# EAGLE design GPRS-Shield-v3.0 (EAGLE 6.4)

## Sheet 1 of 2
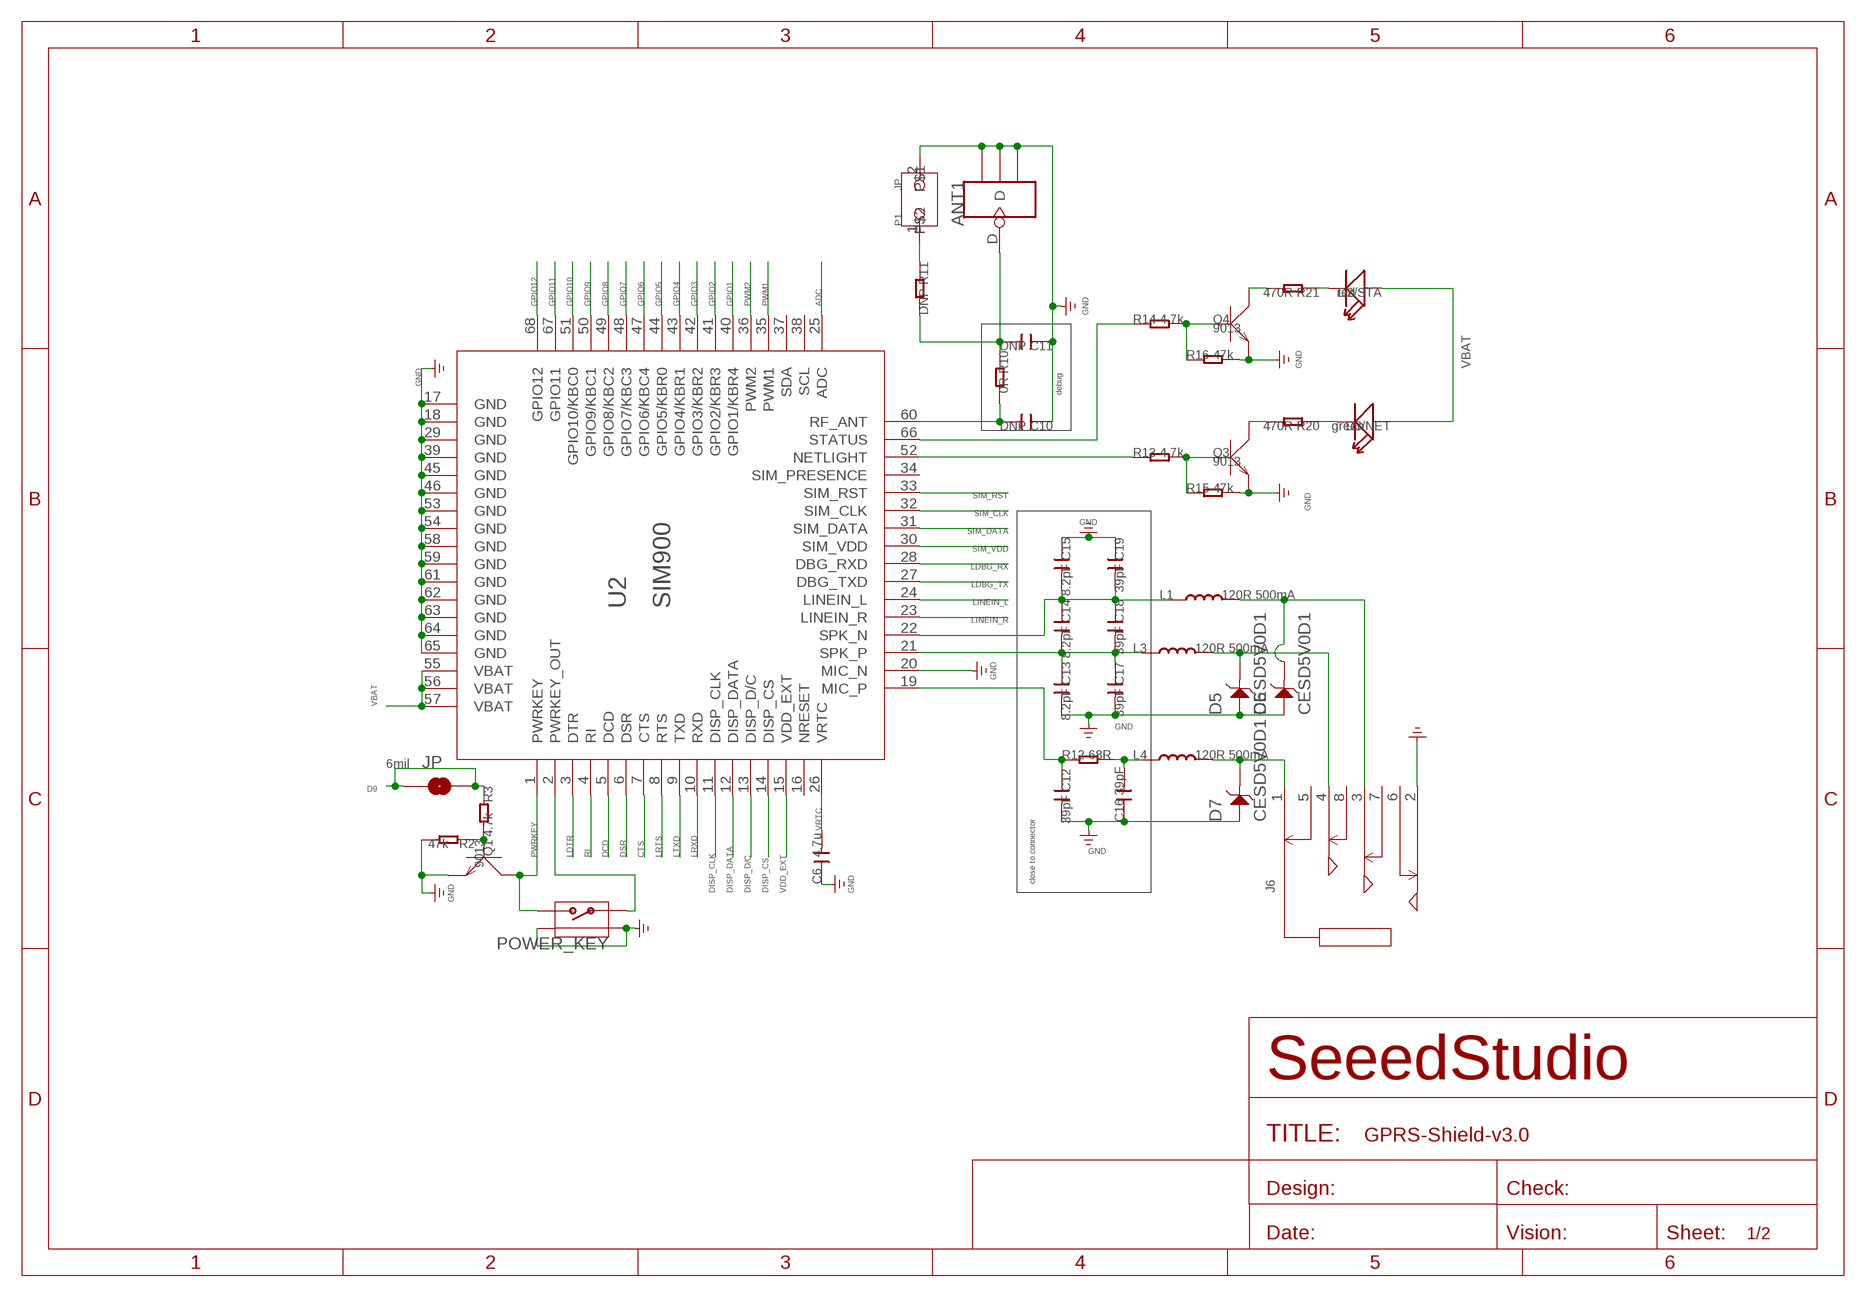
[diagram p0: schematic, sheet 1, part 1 of 2]
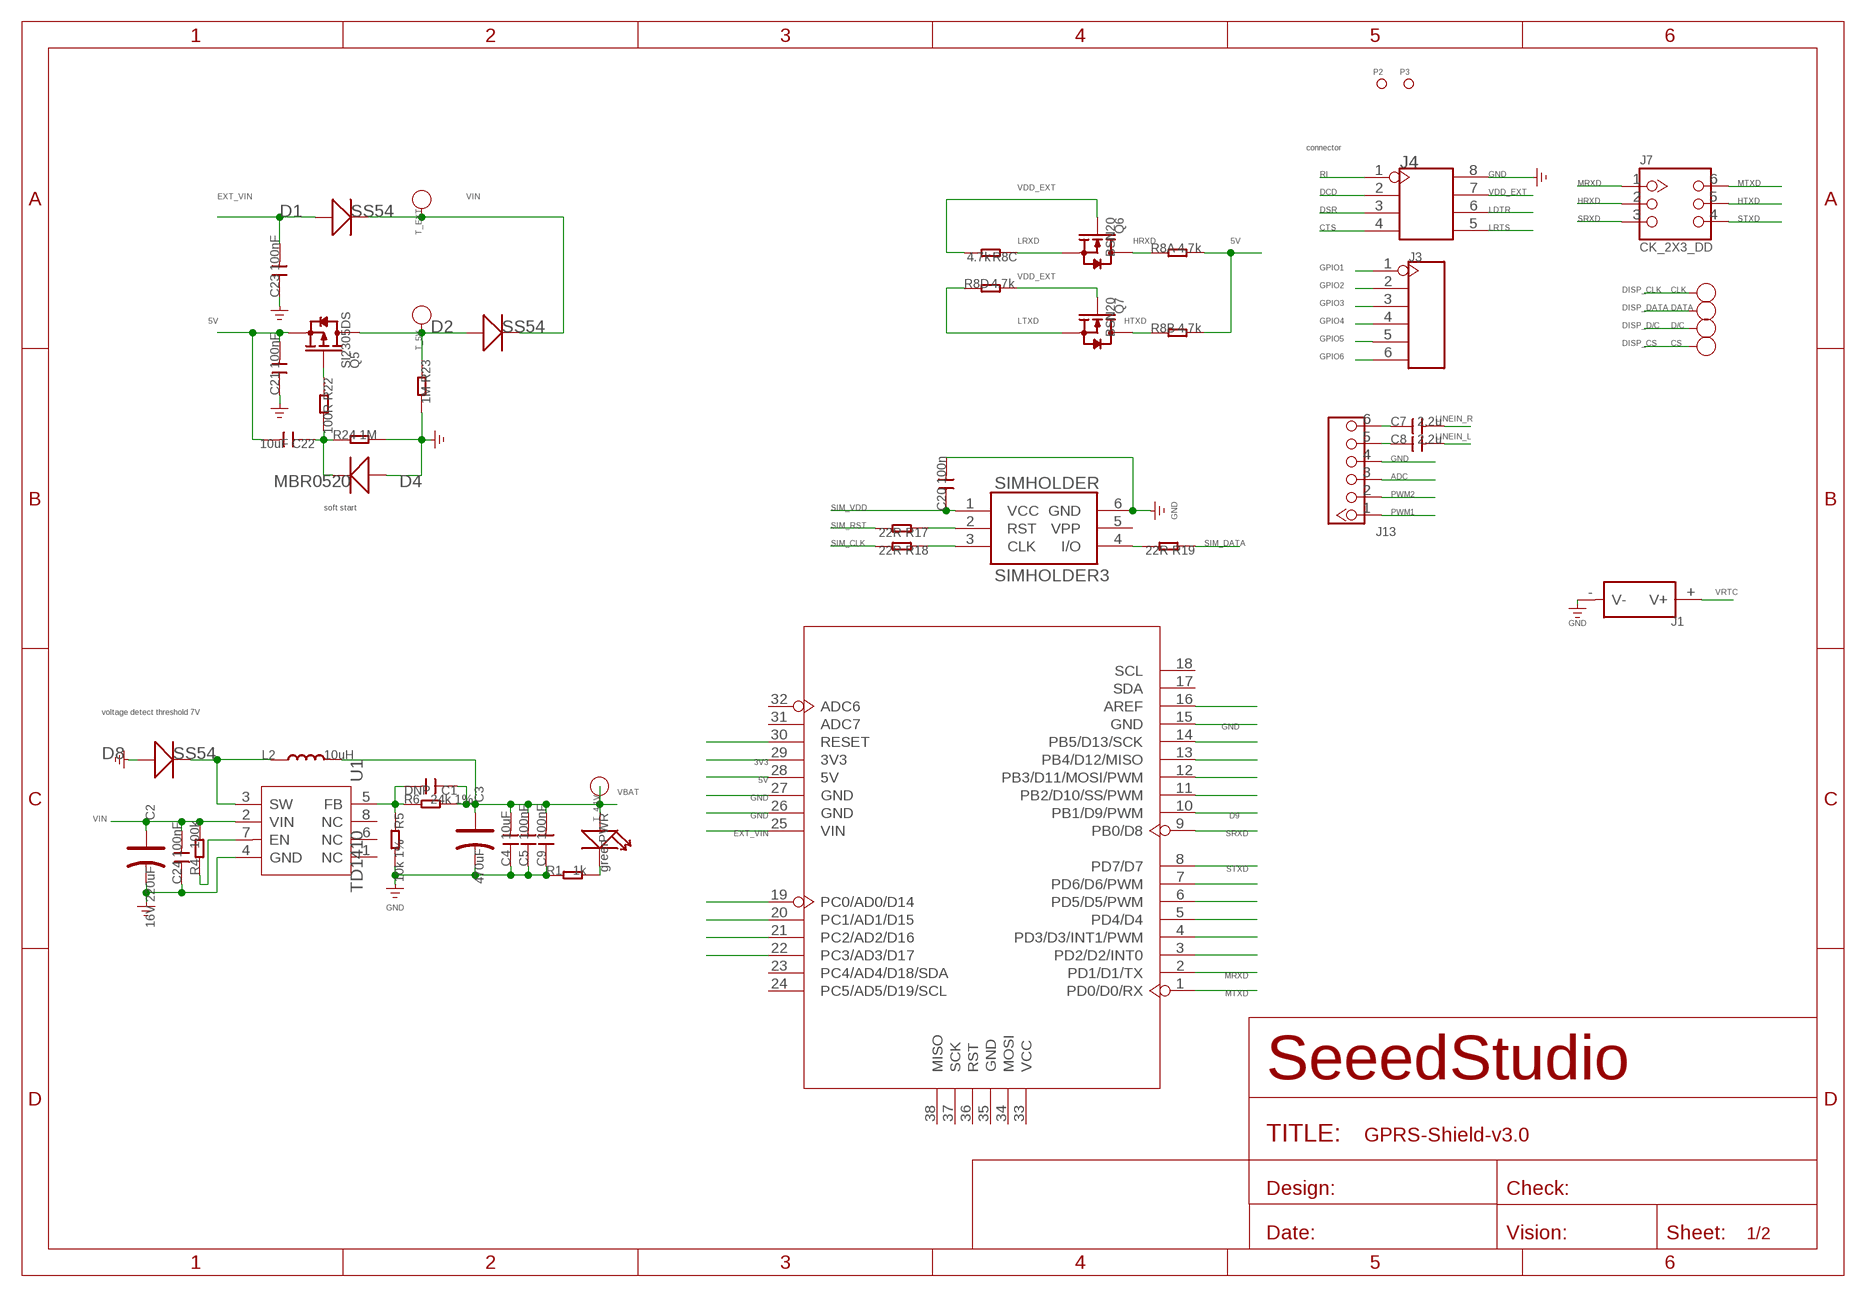
[diagram p1: schematic, sheet 1, part 2 of 2]

### Parts
ANT1  ANTENNA-U-FL  [4P-U-FL]
C1  DNP  C-0603  [C0603]
C2  16V 220uF  CAP-ELECTRO-D  [ELECTRO-SMD-D-5.6MM]
C3  470uF  CAP-AVX-D  [AVX-D]
C4  10uF  C-0805  [C0805]
C5  100nF  C-0603  [C0603]
C6  4.7u  C-0805  [C0805]
C7  2.2u  C-0805  [C0805]
C8  2.2u  C-0805  [C0805]
C9  100nF  C-0603  [C0603]
C10  DNP  C-0603  [C0603]
C11  DNP  C-0603  [C0603]
C12  39pF  C-0603  [C0603]
C13  8.2pF  C-0603  [C0603]
C14  8.2pF  C-0603  [C0603]
C15  8.2pF  C-0603  [C0603]
C16  39pF  C-0603  [C0603]
C17  39pF  C-0603  [C0603]
C18  39pF  C-0603  [C0603]
C19  39pF  C-0603  [C0603]
C20  100n  C-0603  [C0603]
C21  100nF  C-0603  [C0603]
C22  10uF  C-0805  [C0805]
C23  100nF  C-0603  [C0603]
C24  100nF  C-0603  [C0603]
CLK  PAD-TEST-POINT-CIRCLE'4545'  [TP_4545]
CS  PAD-TEST-POINT-CIRCLE'4545'  [TP_4545]
D1  SS54  D'MBRS240LT3'  [SMB]
D2  SS54  D'MBRS240LT3'  [SMB]
D2/STA  red  LED'0603'  [LED-0603]
D3/NET  green  LED'0603'  [LED-0603]
D4  MBR0520  D'MBR0520LT1'  [SOD123-2.7X1.6]
D5  CESD5V0D1  D-ESD  [SOD123-2.7X1.6]
D6  CESD5V0D1  D-ESD  [SOD123-2.7X1.6]
D7  CESD5V0D1  D-ESD  [SOD123-2.7X1.6]
D8  SS54  D'MBRS240LT3'  [SMB]
D/C  PAD-TEST-POINT-CIRCLE'4545'  [TP_4545]
DATA  PAD-TEST-POINT-CIRCLE'4545'  [TP_4545]
J1  HOLDER-BAT  [SMD-CR1220-2]
J3  HEADER-6P-65/35MIL  [6P-2.54-65/35MIL]
J4  HEADER-2X4P-2.54  [2X4P-2.54]
J6  AUDIO-JACK-3.5'PJ-393'  [8P-SMD-3.5]
J7  CK_2X3_DD  [CK_2X3]
J13  HEADER_1X6  [CK_1X6]
JP  PAD-SOLDERJUMPERNC  [2P-SMD-3.3X2]
L1  120R 500mA  L'0603'  [L0603]
L2  10uH  L'0630'  [L0630]
L3  120R 500mA  L'0603'  [L0603]
L4  120R 500mA  L'0603'  [L0603]
P1  JP  [JP]
P2  PAD-MARK  [ROUND-MARK-1.0]
P3  PAD-MARK  [ROUND-MARK-1.0]
POWER_KEY  BUTTON-4P-REINFORCE'TS-118E'  [4P-SMD-7X3.5X3.5H]
PWR  green  007-LED0603  [D0603]
Q1  9013  TRANSISTOR-NPN-SOT23  [SOT23]
Q3  9013  TRANSISTOR-NPN-SOT23  [SOT23]
Q4  9013  TRANSISTOR-NPN-SOT23  [SOT23]
Q5  SI2305DS  MOSFET-P'SI2323CDS/SI2305DS<BR>'  [SOT23]
Q6  BSN20  MOSFET-N'SOT23'  [SOT23]
Q7  BSN20  MOSFET-N'SOT23'  [SOT23]
R1  1k  R-0603  [R0603]
R2  47k  R-0603  [R0603]
R3  4.7k  R-0603  [R0603]
R4  100k  R-0603  [R0603]
R5  10k 1%  R-0603  [R0603]
R6  24k 1%  R-0603  [R0603]
R8  4.7k  R-4R-1206  [1206-8-3.3X2.4]
R10  0R  R-0603  [R0603]
R11  DNP  R-0603  [R0603]
R12  68R  R-0603  [R0603]
R13  4.7k  R-0603  [R0603]
R14  4.7k  R-0603  [R0603]
R15  47k  R-0603  [R0603]
R16  47k  R-0603  [R0603]
R17  22R  R-0603  [R0603]
R18  22R  R-0603  [R0603]
R19  22R  R-0603  [R0603]
R20  470R  R-0603  [R0603]
R21  470R  R-0603  [R0603]
R22  100R  R-0603  [R0603]
R23  1M  R-0603  [R0603]
R24  1M  R-0603  [R0603]
SIMHOLDER  SIMHOLDER3  [SIMHOLDER3]
T_4.1V  PAD-TEST-POINT-CIRCLE'4545'  [TP_4545]
T_5V  PAD-TEST-POINT-CIRCLE'4545'  [TP_4545]
T_EXT  PAD-TEST-POINT-CIRCLE'4545'  [TP_4545]
U1  TD1410  [SOP8]
U2  SIM900  [SIM900]
U4  ARDUINO-38P'WITH/O-SILK'  [ARDUINO-38P-500519002]

### Nets
3V3: U4.29(3V3)
5V: C21.2 C22.2 Q5.2(S) R8.7 R8.8 U4.28(5V)
ADC: J13.3 U2.25(ADC)
CTS: J4.4 U2.7(CTS)
D9: JP.1 JP.2 R3.1 U4.10(PB1/D9/PWM)
DCD: J4.2 U2.5(DCD)
DISP_CLK: CLK.T U2.11(DISP_CLK)
DISP_CS: CS.T U2.14(DISP_CS)
DISP_D/C: D/C.T U2.13(DISP_D/C)
DISP_DATA: DATA.T U2.12(DISP_DATA)
DSR: J4.3 U2.6(DSR)
EXT_VIN: C23.2 D1.+ U4.25(VIN)
GND: ANT1.GND1 ANT1.GND2 ANT1.GND3 C2.- C3.- C4.1 C5.1 C6.1 C9.1 C10.1 C11.1 C12.2 C13.2 C15.1 C16.1 C17.2 C19.1 C20.2 C21.1 C23.1 C24.1 D4.1(+) D5.1 D6.1 D7.1 D8.+ J1.-(V-) J4.8 J6.2 J13.4 P1.2 POWER_KEY.S1 POWER_KEY.S2 Q1.2(E) Q3.2(E) Q4.2(E) R1.1 R2.2 R5.2 R15.2 R16.2 R23.2 R24.2 SIMHOLDER.6(GND) U1.4(GND) U2.17(GND) U2.18(GND) U2.20(MIC_N) U2.29(GND) U2.39(GND) U2.45(GND) U2.46(GND) U2.53(GND) U2.54(GND) U2.58(GND) U2.59(GND) U2.61(GND) U2.62(GND) U2.63(GND) U2.64(GND) U2.65(GND) U4.15(GND) U4.26(GND) U4.27(GND)
GPIO1: J3.1 U2.40(GPIO1/KBR4)
GPIO2: J3.2 U2.41(GPIO2/KBR3)
GPIO3: J3.3 U2.42(GPIO3/KBR2)
GPIO4: J3.4 U2.43(GPIO4/KBR1)
GPIO5: J3.5 U2.44(GPIO5/KBR0)
GPIO6: J3.6 U2.47(GPIO6/KBC4)
GPIO7: U2.48(GPIO7/KBC3)
GPIO8: U2.49(GPIO8/KBC2)
GPIO9: U2.50(GPIO9/KBC1)
GPIO10: U2.51(GPIO10/KBC0)
GPIO11: U2.67(GPIO11)
GPIO12: U2.68(GPIO12)
HRXD: J7.2 Q6.3(D) R8.1
HTXD: J7.5 Q7.3(D) R8.2
LDBG_RX: U2.28(DBG_RXD)
LDBG_TX: U2.27(DBG_TXD)
LDTR: J4.6 U2.3(DTR)
LINEIN_L: C8.2 U2.24(LINEIN_L)
LINEIN_R: C7.2 U2.23(LINEIN_R)
LRTS: J4.5 U2.8(RTS)
LRXD: Q6.2(S) R8.3 U2.10(RXD)
LTXD: Q7.2(S) R8.4 U2.9(TXD)
MRXD: J7.1 U4.2(PD1/D1/TX)
MTXD: J7.6 U4.1(PD0/D0/RX)
N$1: C10.2 R10.2 U2.60(RF_ANT)
N$2: D2.+ Q5.3(D) R23.1 T_5V.T
N$3: Q3.3(C) R20.2
N$4: R19.2 SIMHOLDER.4(I/O)
N$5: R18.1 SIMHOLDER.3(CLK)
N$6: R17.1 SIMHOLDER.2(RST)
N$7: D3/NET.- R20.1
N$8: Q3.1(B) R13.2 R15.1
N$9: PWR.- R1.2
N$10: R13.1 U2.52(NETLIGHT)
N$11: POWER_KEY.1 U2.2(PWRKEY_OUT)
N$12: R4.1 U1.7(EN)
N$13: C12.1 R12.1 U2.19(MIC_P)
N$15: C13.1 C14.2 C17.1 C18.2 L3.1 U2.21(SPK_P)
N$16: Q4.3(C) R21.2
N$17: D2/STA.- R21.1
N$18: Q4.1(B) R14.2 R16.1
N$19: C14.1 C15.2 C18.1 C19.2 L1.1 U2.22(SPK_N)
N$20: R14.1 U2.66(STATUS)
N$21: ANT1.D C11.2 R10.1 R11.2
N$23: C7.1 J13.6
N$24: U4.3(PD2/D2/INT0)
N$25: U4.4(PD3/D3/INT1/PWM)
N$26: U4.5(PD4/D4)
N$27: U4.6(PD5/D5/PWM)
N$28: U4.7(PD6/D6/PWM)
N$29: C8.1 J13.5
N$30: C16.2 L4.1 R12.2
N$31: Q5.1(G) R22.1
N$32: U4.11(PB2/D10/SS/PWM)
N$33: U4.12(PB3/D11/MOSI/PWM)
N$34: U4.13(PB4/D12/MISO)
N$35: U4.14(PB5/D13/SCK)
N$36: Q1.1(B) R2.1 R3.2
N$37: U4.16(AREF)
N$38: D8.- L2.1 U1.3(SW)
N$39: C22.1 D4.2(-) R22.2 R24.1
N$41: U4.22(PC3/AD3/D17)
N$42: U4.21(PC2/AD2/D16)
N$43: U4.20(PC1/AD1/D15)
N$44: U4.19(PC0/AD0/D14)
N$45: D7.2 J6.1 L4.2
N$47: C1.2 R5.1 R6.1 U1.5(FB)
N$48: D5.2 J6.4 L3.2
N$50: U4.30(RESET)
N$51: D6.2 J6.3 L1.2
N$52: P1.1 R11.1
PWM1: J13.1 U2.35(PWM1)
PWM2: J13.2 U2.36(PWM2)
PWRKEY: POWER_KEY.2 Q1.3(C) U2.1(PWRKEY)
RI: J4.1 U2.4(RI)
SIM_CLK: R18.2 U2.32(SIM_CLK)
SIM_DATA: R19.1 U2.31(SIM_DATA)
SIM_RST: R17.2 U2.33(SIM_RST)
SIM_VDD: C20.1 SIMHOLDER.1(VCC) U2.30(SIM_VDD)
SRXD: J7.3 U4.9(PB0/D8)
STXD: J7.4 U4.8(PD7/D7)
VBAT: C1.1 C3.+ C4.2 C5.2 C9.2 D2/STA.+ D3/NET.+ L2.2 PWR.+ R6.2 T_4.1V.T U2.55(VBAT) U2.56(VBAT) U2.57(VBAT)
VDD_EXT: J4.7 Q6.1(G) Q7.1(G) R8.5 R8.6 U2.15(VDD_EXT)
VIN: C2.+ C24.2 D1.- D2.- R4.2 T_EXT.T U1.2(VIN)
VRTC: C6.2 J1.+(V+) U2.26(VRTC)
Unconnected: J6.5 J6.6 J6.7 J6.8 SIMHOLDER.5(VPP) U1.1(NC) U1.6(NC) U1.8(NC) U2.16(NRESET) U2.34(SIM_PRESENCE) U2.37(SDA) U2.38(SCL) U4.17(SDA) U4.18(SCL) U4.23(PC4/AD4/D18/SDA) U4.24(PC5/AD5/D19/SCL) U4.31(ADC7) U4.32(ADC6) U4.33(VCC) U4.34(MOSI) U4.35(GND) U4.36(RST) U4.37(SCK) U4.38(MISO)

### Notes on the sheet
- connector
- debug
- soft start
- voltage detect threshold 7V
- 6mil
- close to connector

## Sheet 2 of 2
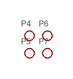
[diagram p2: schematic, sheet 2]

### Parts
P4  PAD-MARK  [ROUND-MARK-1.0]
P5  PAD-MARK  [ROUND-MARK-1.0]
P6  PAD-MARK  [ROUND-MARK-1.0]
P7  PAD-MARK  [ROUND-MARK-1.0]

## Library data of the parts
ANT1 = Connector:ANTENNA-U-FL
C1 C4-C24 = Discrete:C*: Ceramic Capacitors
C2 C3 = Discrete:CAP*: Electrolytic Capacitors,Tantalum Capacitors and Super Capacitors
CLK CS D/C DATA T_4.1V T_5V T_EXT = Discrete:PAD-TEST-POINT-CIRCLE; PARTNO: DNP
D1 D2 D4 D8 = Discrete:D*
D2/STA D3/NET = Discrete:LED*
D5-D7 = template:D-ESD: Diodes for Protectiong against ESD
J1 = Connector:HOLDER-BAT: button cell holder
J3 = Connector:HEADER-6P
J4 = Connector:HEADER-2X4P
J6 = template:AUDIO-JACK-3.5
J7 = CONNECTER:CK_2X3
J13 = CONNECTER:HEADER_1X6
JP = Discrete:PAD-SOLDERJUMPER: Solder Jumper Standard SMD solder jumper. Used to automate production. Two varients : Normally Open and Normally Closed are the same, but have different paste layers. NC will have a large amount of paste and should jumper during reflow.
L1-L4 = Discrete:L*
P1 = mySeeed:JP
P2-P7 = Discrete:PAD-MARK; PARTNO: DNP
POWER_KEY = Discrete:BUTTON-4P-REINFORCE: TS-1188E http://www.best-dz.com/?thread-374-2.html
PWR = Discrete:007-LED*
Q1 Q3 Q4 = Discrete:TRANSISTOR-NPN*: NPN audion
Q5 = Discrete:MOSFET-P
Q6 Q7 = Discrete:MOSFET-N: IRLL014: http://www.vishay.com/docs/91319/sihll014.pdf
R1-R6 R10-R24 = Discrete:R*
R8 = Discrete:R-4R*: Resistor Array
SIMHOLDER = SparkFun2:SIMHOLDER3
U1 = template:TD1410: 2A 380KHz 20V PWM Buck DC/DC Converter
U2 = ICs_v54:SIM900
U4 = moudle:ARDUINO-38P

## Net classes
0 default: clearance 0.152 mm

## Board
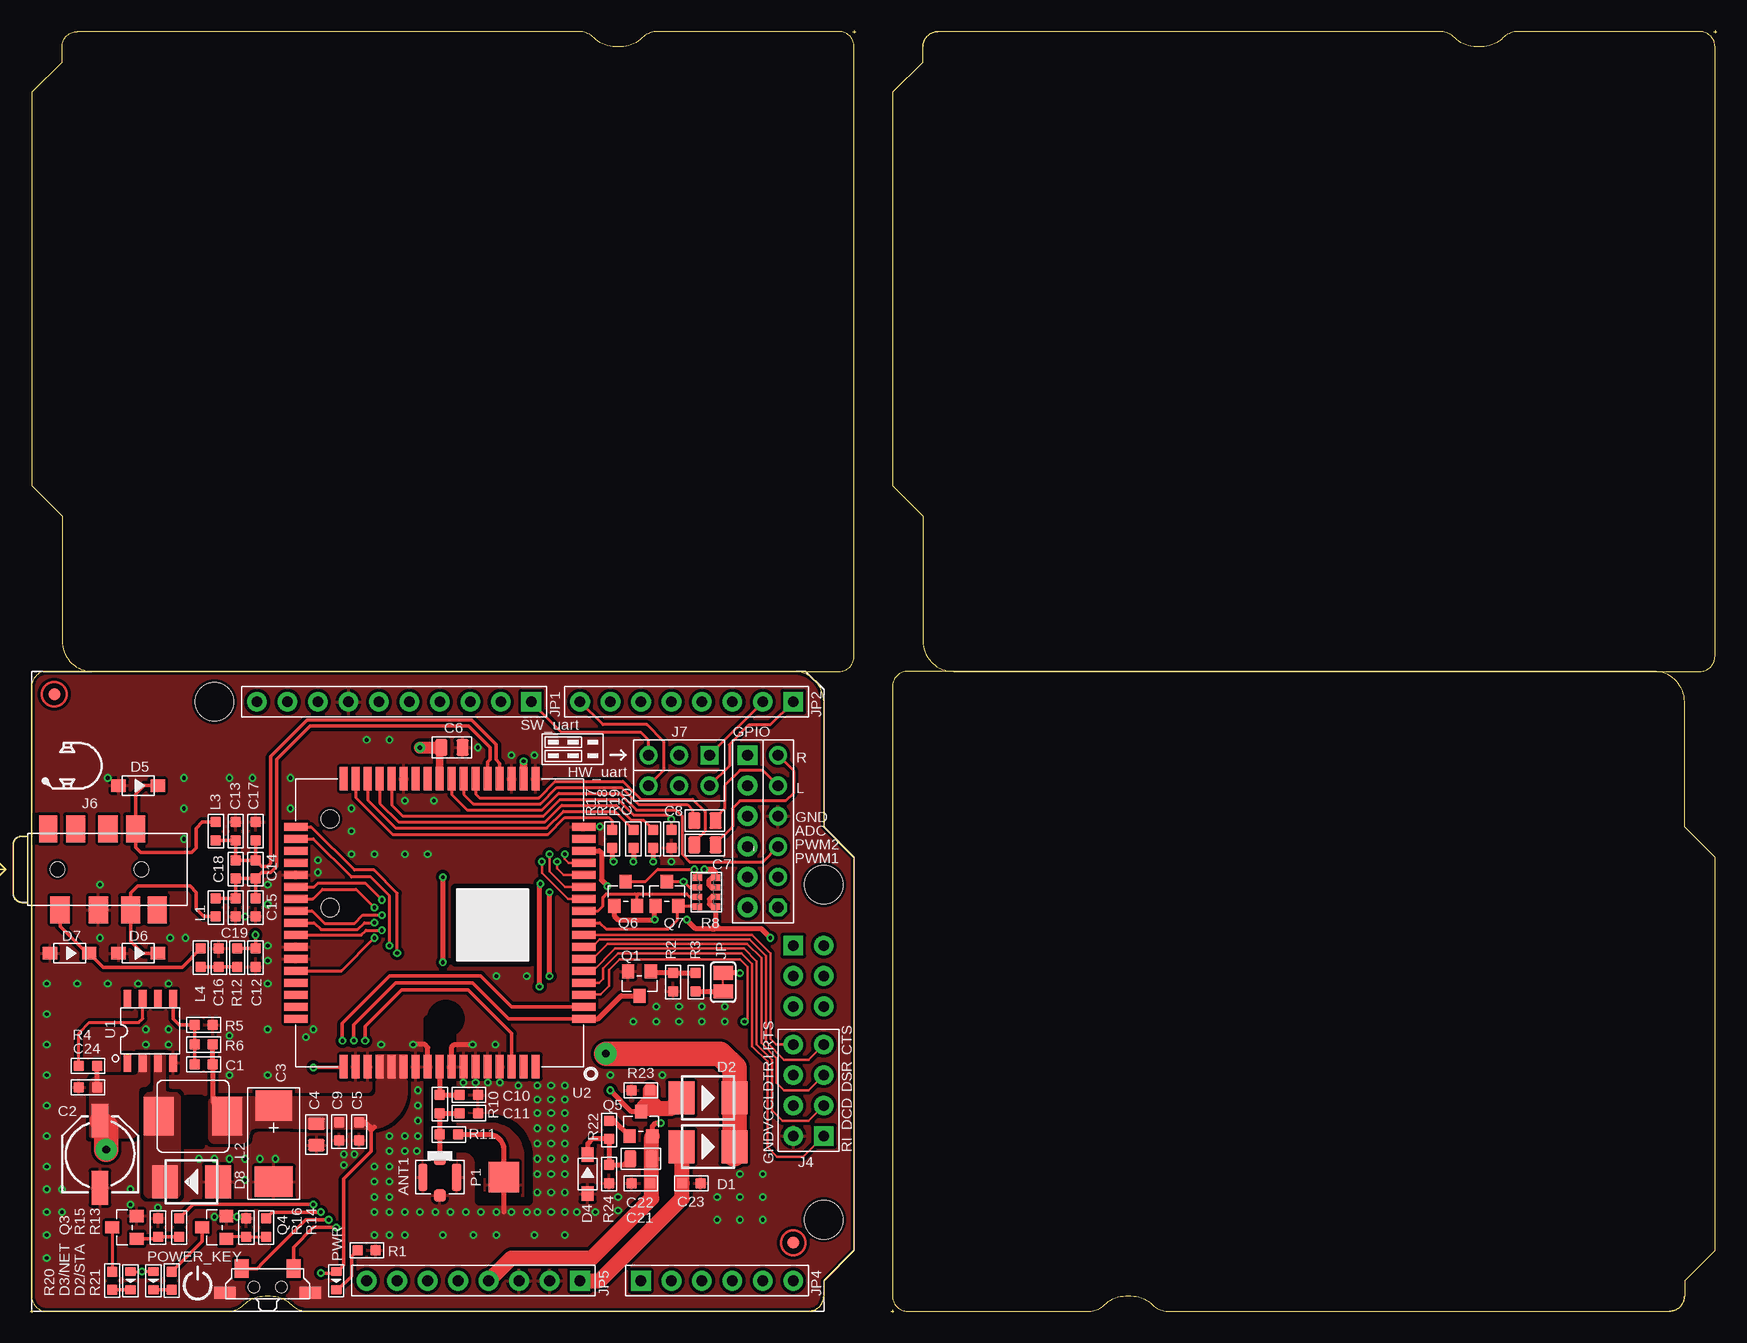
[diagram p3: board, top side]
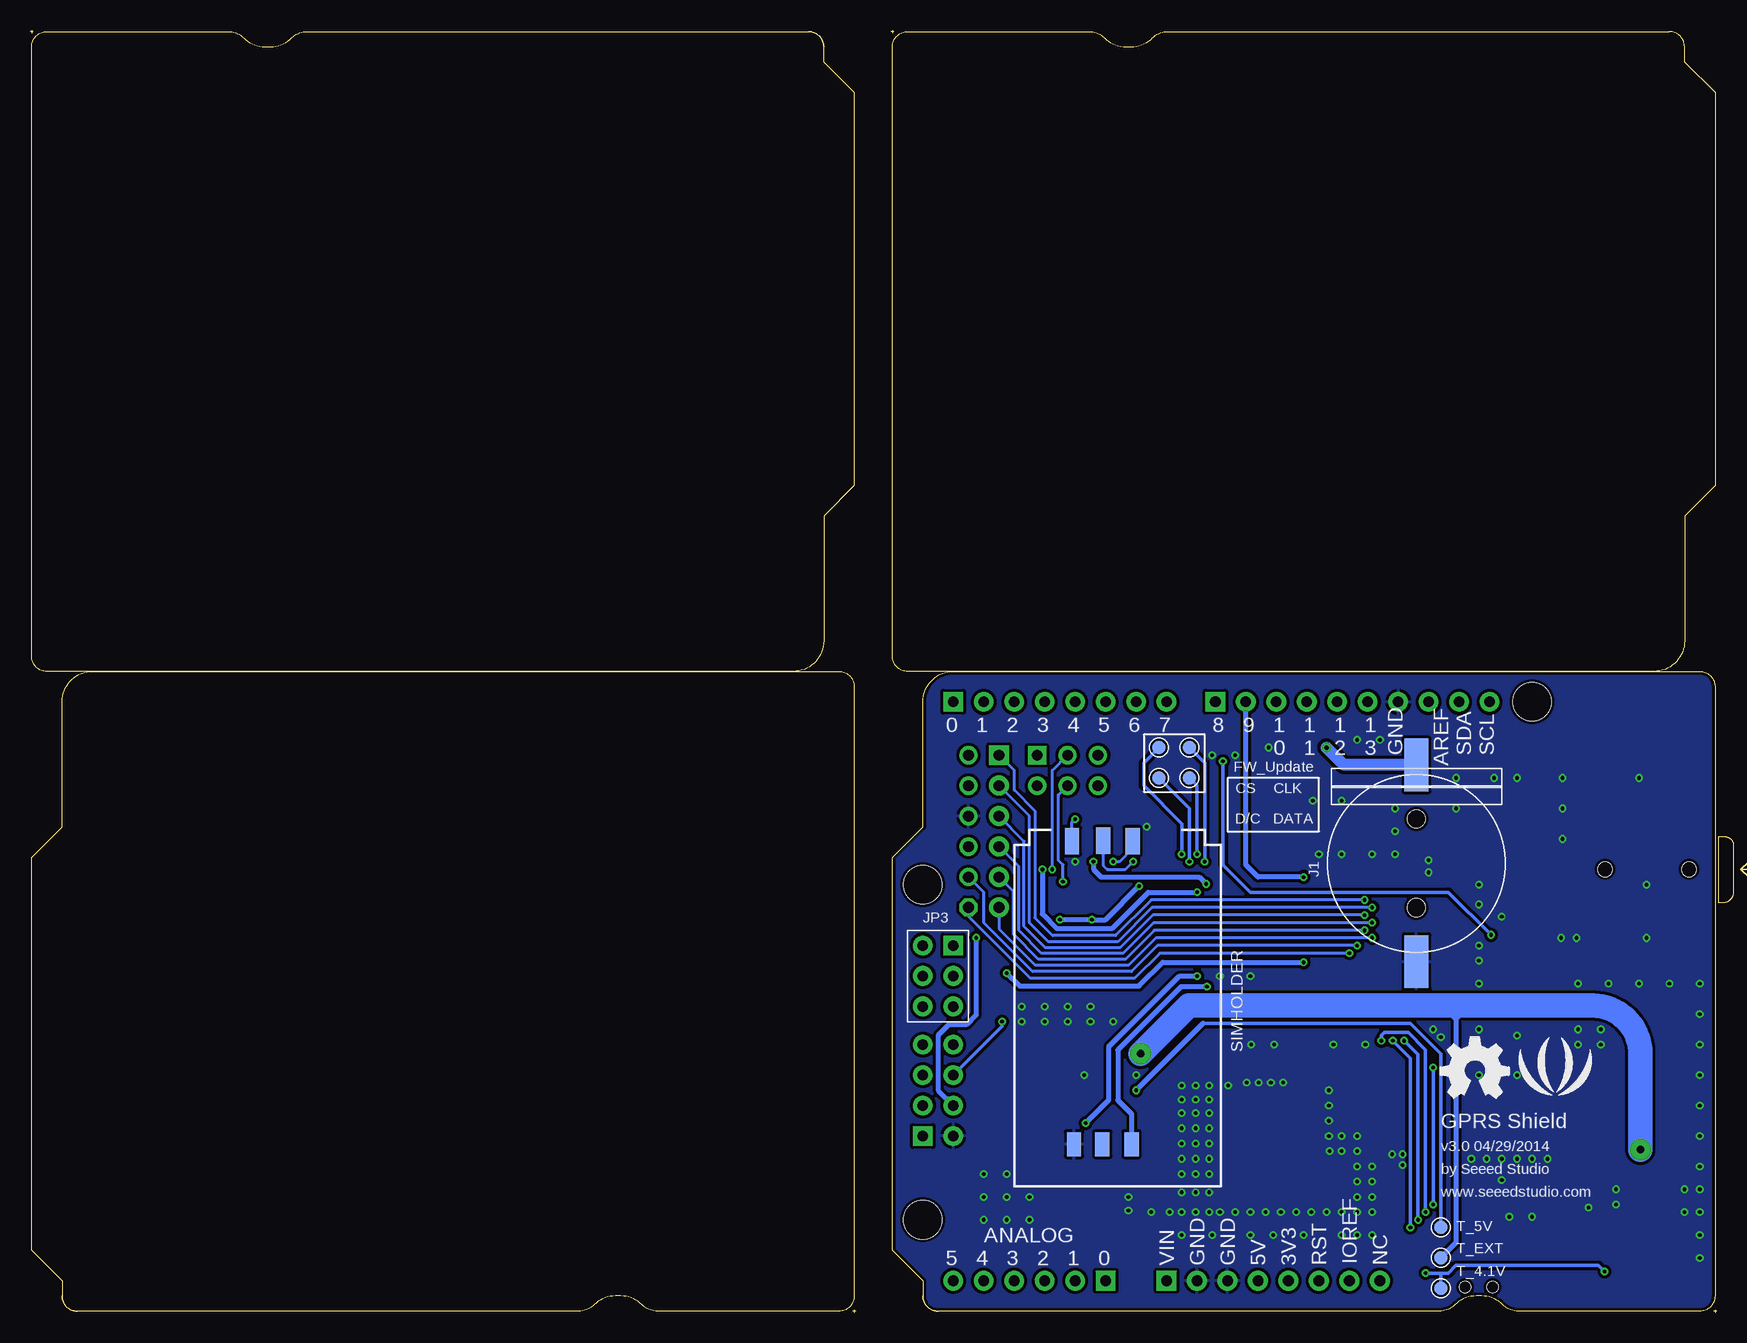
[diagram p4: board, bottom side, seen from below]

Size 140.59 x 106.93 mm. Coordinates in mm from the lower left corner, seen from the top.
Outline: 66.17,50.93 arc90 63.63,53.47
Outline: 1.4,53.47 arc90 0.13,52.2
Outline: 0.13,1.4 arc90 1.4,0.13
Outline: 64.9,0.13 arc90 66.17,1.4
Outline: 1.4,53.47 arc90 0.13,52.2
Outline: 0.13,1.4 arc90 1.4,0.13
Outline: 64.9,0.13 arc90 66.17,1.4
Outline: 66.17,50.93 arc90 63.63,53.47
Outline: 139.19,53.47 arc90 140.46,54.74
Outline: 140.46,105.54 arc90 139.19,106.81
Outline: 75.69,106.81 arc90 74.42,105.54
Outline: 74.42,56.01 arc90 76.96,53.47
Outline: 73.15,53.47 arc90 71.88,52.2
Outline: 137.92,50.93 arc90 135.38,53.47
Outline: 0.13,1.4 arc90 1.4,0.13
Outline: 64.9,0.13 arc90 66.17,1.4
Outline: 73.15,53.47 arc90 71.88,52.2
Outline: 71.88,1.4 arc90 73.15,0.13
Outline: 136.65,0.13 arc90 137.92,1.4
Outline: 137.92,50.93 arc90 135.38,53.47
Outline: 1.4,53.47 arc90 0.13,52.2
Outline: 0.13,1.4 arc90 1.4,0.13
Outline: 64.9,0.13 arc90 66.17,1.4
Outline: 66.17,50.93 arc90 63.63,53.47
Outline: 74.42,105.54 74.42,104.27 71.88,101.73 71.88,68.96 74.42,66.42 74.42,56.01
Outline: 74.42,105.54 arc-90 75.69,106.81
Outline: 76.96,53.47 139.19,53.47
Outline: 139.19,53.47 arc90 140.46,54.74
Outline: 140.46,54.74 140.46,105.54
Outline: 140.46,105.54 arc90 139.19,106.81
Outline: 74.42,56.01 arc90 76.96,53.47
Outline: 75.69,106.81 117.49,106.81 arc-45 118.76,106.28 arc45 120.56,105.54 120.99,105.54 arc45 122.79,106.28 arc-45 124.06,106.81 139.19,106.81
Outline: 66.17,1.4 66.17,2.67 68.71,5.21 68.71,37.97 66.17,40.51 66.17,50.93
Outline: 66.17,1.4 arc-90 64.9,0.13
Outline: 63.63,53.47 1.4,53.47
Outline: 1.4,53.47 arc90 0.13,52.2
Outline: 0.13,52.2 0.13,1.4
Outline: 0.13,1.4 arc90 1.4,0.13
Outline: 66.17,50.93 arc90 63.63,53.47
Outline: 64.9,0.13 23.1,0.13 arc-45 21.83,0.65 arc45 20.03,1.4 19.59,1.4 arc45 17.8,0.65 arc-45 16.53,0.13 1.4,0.13
Outline: 137.92,1.4 137.92,2.67 140.46,5.21 140.46,37.97 137.92,40.51 137.92,50.93
Outline: 137.92,1.4 arc-90 136.65,0.13
Outline: 135.38,53.47 73.15,53.47
Outline: 73.15,53.47 arc90 71.88,52.2
Outline: 71.88,52.2 71.88,1.4
Outline: 71.88,1.4 arc90 73.15,0.13
Outline: 137.92,50.93 arc90 135.38,53.47
Outline: 136.65,0.13 94.85,0.13 arc-45 93.58,0.65 arc45 91.78,1.4 91.35,1.4 arc45 89.55,0.65 arc-45 88.28,0.13 73.15,0.13
Outline: 0,0.13 0.25,0.13
Outline: 0.13,0.25 0.13,0
Outline: 71.75,0.13 72.01,0.13
Outline: 71.88,0.25 71.88,0
Outline: 68.58,106.81 68.83,106.81
Outline: 68.71,106.93 68.71,106.68
Outline: 140.34,106.81 140.59,106.81
Outline: 140.46,106.93 140.46,106.68
Outline: 2.67,104.27 2.67,105.54 arc-90 3.94,106.81 45.74,106.81 arc-45 47.01,106.28 arc45 48.8,105.54 49.24,105.54 arc45 51.04,106.28 arc-45 52.31,106.81 67.44,106.81 arc-90 68.71,105.54 68.71,54.74 arc-90 67.44,53.47 5.21,53.47 arc-90 2.67,56.01 2.67,66.42 0.13,68.96 0.13,101.73 2.67,104.27
Copper layers (1*16): Top 0.035mm / dielectric 1.5mm / Bottom 0.035mm
Design rules "default *": minimum track width 6mil, minimum drill 12mil, track to track 6mil, track to pad 6mil, pad to pad 6mil, via to via 6mil, smd to smd 0mil, copper to edge 10mil, drill to drill 10mil, minimum pad ring 10mil, minimum via ring 6mil, stop-mask expansion 2mil, vias tented up to drill 100mil, thermal gap 10mil
Holes 2.03 mm at 7.75,111.25 132.84,111.25 132.84,-4.32 7.75,-4.32
tRestrict: area 13.1,13.9 to 14.4,17.9; area 36.6,20.2 to 36.7,21; area 37.6,20.1 to 37.7,20.9; area 38.6,20.2 to 38.7,21; area 27.6,20.1 to 27.7,20.8; area 21.8,30 to 22.5,30.1; 15 lines

### Footprints (pad centres in the part's own frame; a part is rotated, then mirrored left to right if it is on the bottom)
4P-U-FL = smd 1.016 x 1.016: D -1.524,0; GND3 1.524,0 | smd 2.286 x 0.762: GND1 0,1.397; GND2 0,-1.397
C0603 = smd 0.889 x 0.889: 1 -0.762,0; 2 0.762,0
ELECTRO-SMD-D-5.6MM = smd 2.794 x 1.397: + 2.794,0; - -2.794,0
AVX-D = smd 2.54 x 3.048: + -3.175,0 | smd 2.54 x 3.175: - 3.175,0
C0805 = smd 1.016 x 1.397: 1 -0.889,0; 2 0.889,0
TP_4545 = smd 1.143 x 1.143: T 0,0
SMB = smd 2.159 x 2.743: + -2.21,0; - 2.21,0
D0603 = smd 0.762 x 0.889: + -0.762,0; - 0.762,0
SOD123-2.7X1.6 = smd 1.2 x 1.02: 1 -1.635,0; 2 1.635,0
SMD-CR1220-2 = smd 2 x 4.4: + 0,-8.2; - 0,8.2 | hole 1.5: 0,3.7; 0,-3.7
6P-2.54-65/35MIL = drill 0.889 pad 1.651 square: 1 0,6.35 | drill 0.889 pad 1.651: 2 0,3.81; 3 0,1.27; 4 0,-1.27; 5 0,-3.81; 6 0,-6.35
2X4P-2.54 = drill 0.889 pad 1.651 square: 1 -1.27,3.81 | drill 0.889 pad 1.651: 2 -1.27,1.27; 3 -1.27,-1.27; 4 -1.27,-3.81; 5 1.27,-3.81; 6 1.27,-1.27; 7 1.27,1.27; 8 1.27,3.81
8P-SMD-3.5 = smd 1.6 x 2.25: 1 3.9,-3.375; 2 7.1,-3.375; 3 9.8,-3.375; 4 10.2,3.375; 6 5.2,3.375; 7 7.9,3.375; 8 12,-3.375 | smd 1.5 x 2.25: 5 2.9,3.375 | hole 1.2: 3.7,0; 10.7,0
CK_2X3 = drill 0.889 pad 1.524 square: 1 -1.27,2.54 | drill 0.889 pad 1.524: 2 -1.27,0; 3 -1.27,-2.54; 4 1.27,-2.54; 5 1.27,0; 6 1.27,2.54
CK_1X6 = drill 0.889 pad 1.524 octagon: 1 0,6.35 | drill 0.889 pad 1.524: 2 0,3.81; 3 0,1.27; 4 0,-1.27; 5 0,-3.81; 6 0,-6.35
2P-SMD-3.3X2 = smd 1.168 x 1.6: 1 -0.762,0; 2 0.762,0
L0603 = smd 0.889 x 0.889: 1 -0.762,0; 2 0.762,0
L0630 = smd 2.5 x 3.2: 1 -2.85,0; 2 2.85,0
JP = smd 1.27 x 2.54: 1 -0.635,0; 2 0.635,0
ROUND-MARK-1.0 = smd 1.016 x 1.016: P$1 0,0
4P-SMD-7X3.5X3.5H = smd 1.143 x 1.524: 1 -2.159,1.524; 2 2.159,1.524 | smd 1.778 x 1.016: S1 -3.556,-0.508; S2 3.556,-0.508 | hole 0.95: -1.15,0; 1.15,0
SOT23 = smd 1.016 x 1.143: 1 -0.95,-1.016; 2 0.95,-1.016; 3 0,1.016
R0603 = smd 0.889 x 0.889: 1 -0.762,0; 2 0.762,0
1206-8-3.3X2.4 = smd 0.508 x 0.762: 1 -1.206,-0.762; 2 -0.381,-0.762; 3 0.381,-0.762; 4 1.206,-0.762; 5 1.206,0.762; 6 0.381,0.762; 7 -0.381,0.762; 8 -1.206,0.762
SIMHOLDER3 = smd 2.2 x 1.2: 1 0.95,4.81; 2 0.91,7.41; 3 0.95,9.86 | smd 2 x 1.2: 4 26.2,9.78; 5 26.22,7.34; 6 26.22,4.98
SOP8 = smd 0.635 x 1.524: 1 -1.905,-2.667; 2 -0.635,-2.667; 3 0.635,-2.667; 4 1.905,-2.667; 5 1.905,2.667; 6 0.635,2.667; 7 -0.635,2.667; 8 -1.905,2.667
SIM900 = smd 1.93 x 0.66: 1 -12,8; 2 -12,7; 3 -12,6; 4 -12,5; 5 -12,4; 6 -12,3; 7 -12,2; 8 -12,1; 9 -12,0; 10 -12,-1; 11 -12,-2; 12 -12,-3; 13 -12,-4; 14 -12,-5; 15 -12,-6; 16 -12,-7; 17 -12,-8; 35 12,-8; 36 12,-7; 37 12,-6; 38 12,-5; 39 12,-4; 40 12,-3; 41 12,-2; 42 12,-1; 43 12,0; 44 12,1; 45 12,2; 46 12,3; 47 12,4; 48 12,5; 49 12,6; 50 12,7; 51 12,8 | smd 0.66 x 1.93: 18 -8,-12; 19 -7,-12; 20 -6,-12; 21 -5,-12; 22 -4,-12; 23 -3,-12; 24 -2,-12; 25 -1,-12; 26 0,-12; 27 1,-12; 28 2,-12; 29 3,-12; 30 4,-12; 31 5,-12; 32 6,-12; 33 7,-12; 34 8,-12; 52 8,12; 53 7,12; 54 6,12; 55 5,12; 56 4,12; 57 3,12; 58 2,12; 59 1,12; 60 0,12; 61 -1,12; 62 -2,12; 63 -3,12; 64 -4,12; 65 -5,12; 66 -6,12; 67 -7,12; 68 -8,12
ARDUINO-38P-500519002 = drill 0.889 pad 1.651 square: 1 63.5,50.8; 9 41.656,50.8; 19 50.8,2.54; 25 45.72,2.54; 38 63.5,30.48 | drill 0.889 pad 1.651: 2 60.96,50.8; 3 58.42,50.8; 4 55.88,50.8; 5 53.34,50.8; 6 50.8,50.8; 7 48.26,50.8; 8 45.72,50.8; 10 39.116,50.8; 11 36.576,50.8; 12 34.036,50.8; 13 31.496,50.8; 14 28.956,50.8; 15 26.416,50.8; 16 23.876,50.8; 17 21.336,50.8; 18 18.796,50.8; 20 53.34,2.54; 21 55.88,2.54; 22 58.42,2.54; 23 60.96,2.54; 24 63.5,2.54; 26 43.18,2.54; 27 40.64,2.54; 28 38.1,2.54; 29 35.56,2.54; 30 33.02,2.54; 31 30.48,2.54; 32 27.94,2.54; 33 66.04,30.48; 34 66.04,27.94; 35 66.04,25.4; 36 63.5,25.4; 37 63.5,27.94 | hole 3.2: 15.24,50.8; 66.04,35.56; 66.04,7.62

### Placement (x,y rotation side)
ANT1  34.16,11.3 270 top
C1  14.48,20.7 180 top
C2  5.84,13.21 90 top
C3  20.32,14.1 270 top
C4  23.88,14.86 90 top
C5  27.43,15.11 90 top
C6  35.18,47.12 180 top
C7  56.26,38.99 180 top
C8  56.26,41.02 180 top
C9  25.78,15.11 90 top
C10  36.58,18.16 180 top
C11  36.58,16.64 180 top
C12  18.8,29.59 270 top
C13  17.14,40.13 90 top
C14  18.8,36.96 90 top
C15  18.8,33.78 90 top
C16  15.75,29.59 270 top
C17  18.8,40.13 90 top
C18  17.14,36.96 90 top
C19  17.14,33.78 90 top
C20  53.47,39.5 270 top
C21  50.93,10.79 0 top
C22  50.93,12.83 0 top
C23  55.12,10.79 180 top
C24  4.83,18.8 0 top
CLK  43.94,47.12 270 bottom
CS  46.48,47.12 270 bottom
D1  56.52,13.84 0 top
D2  56.52,17.91 0 top
D2/STA  red  [D0603]  10.29,2.67 270 top
D3/NET  green  [D0603]  8.38,2.67 270 top
D4  46.48,11.56 90 top
D5  9.02,43.94 0 top
D6  9.02,29.97 0 top
D7  3.3,29.97 0 top
D8  13.46,10.92 180 top
D/C  46.48,44.58 270 bottom
DATA  43.94,44.58 270 bottom
J1  25.02,37.47 180 bottom
J3  59.82,40.13 0 top
J4  64.9,18.54 180 top
J6  -1.4,36.96 0 top
J7  54.1,45.21 270 top
J13  62.36,40.13 180 top
JP  57.79,27.56 90 top
L1  15.49,33.78 270 top
L2  13.59,16.38 0 top
L3  15.49,40.13 90 top
L4  14.22,29.59 90 top
P1  39.5,11.3 270 top
P2  63.63,5.84 0 top
P3  2.03,51.56 0 top
P4  2.67,-4.32 0 top  (outside the outline)
P5  137.92,-4.32 0 top  (outside the outline)
P6  2.67,111.25 0 top  (outside the outline)
P7  137.92,111.25 0 top  (outside the outline)
POWER_KEY  19.81,2.16 0 top
PWR  25.53,2.67 270 top
Q1  50.8,27.43 180 top
Q3  7.87,7.11 90 top
Q4  15.37,7.11 90 top
Q5  50.93,15.75 0 top
Q6  49.66,34.93 0 top
Q7  53.09,34.93 0 top
R1  28.07,5.21 180 top
R2  53.59,27.56 270 top
R3  55.5,27.56 90 top
R4  4.83,20.57 0 top
R5  14.48,24 0 top
R6  14.48,22.35 0 top
R8  56.39,35.06 270 top
R10  34.16,17.4 90 top
R11  34.93,14.86 180 top
R12  17.27,29.59 270 top
R13  12.45,7.11 270 top
R14  19.68,7.11 270 top
R15  10.67,7.11 90 top
R16  18.03,7.11 90 top
R17  48.51,39.5 90 top
R18  50.29,39.5 90 top
R19  51.94,39.5 270 top
R20  6.86,2.67 90 top
R21  11.81,2.67 90 top
R22  48.26,15.24 270 top
R23  50.93,18.54 180 top
R24  48.26,11.56 270 top
SIMHOLDER  58.55,40.26 270 bottom
T_4.1V  22.99,2.03 270 bottom
T_5V  22.99,7.11 0 bottom
T_EXT  22.99,4.57 0 bottom
U1  10.03,23.49 0 top
U2  34.16,32.51 180 top
U4  0.13,0.13 0 top
U$26  [LOGO_SILK]  13.46,19.81 0 bottom
U$28  [OSHW_FILLX200_NOTEXT]  22.99,17.91 0 bottom

### Tracks (layer width: path | path; a pad name or v marks a point on that pad's centre or on a via)
5V  (via drill 0.3 pad 0.64)
  Top 0.406: R8.8 57.1,36.27 | v43.31,28.07 v43.31,35.05 | R8.8 56.81,36.27 56.62,36.07 56.62,35.63 56.8,35.44 R8.7 | C22.2 51.82,10.92 C21.2 | Q5.2 51.88,15.54 52.15,15.81 v52.58,15.81 | R8.8 57.15,36.71 56.9,36.96 v56.2,36.96
  Top 1.27: U4.28 40.13,4.57 46.86,4.57 51.82,9.53 C22.2 51.82,14.67 Q5.2
  Bottom 0.406: v43.31,35.05 47.37,35.05 50.41,32.02 54.99,32.02 56.2,33.23 v56.2,36.96 | v43.31,28.07 44.77,28.07 50.67,22.16 50.67,17.72 v52.58,15.81
ADC
  Top 0.254: U2.25 35.16,43.2 36.45,41.91 42.67,41.91 44.07,43.31 49.15,43.31 50.55,41.91 53.85,41.91 54.36,41.4 54.36,38.23 54.99,37.59 61.09,37.59 J13.3
CTS
  Top 0.203: J4.4 64.9,21.08 62.87,21.08 61.34,22.61 61.34,29.77 59.99,31.11 47.5,31.11 46.9,30.51 U2.7
D9  (via drill 0.3 pad 0.64)
  Top 0.152: JP.1 JP.2
  Top 0.406: v34.42,29.21 v34.42,36.32 | R3.1 JP.1 | v59.18,28.32 JP.2
  Bottom 0.406: v59.18,28.32 58.09,27.23 48.15,27.23 46.16,29.21 v34.42,29.21 | v34.42,36.32 38.23,36.32 39.24,37.34 U4.10
DCD
  Top 0.203: J4.2 64.9,16 62.74,16 61.85,16.89 61.85,21.08 60.58,22.35 60.58,29.27 59.5,30.35 48.77,30.35 46.93,28.51 U2.5
DISP_CLK  (via drill 0.3 pad 0.64)
  Top 0.203: U2.11 44.84,34.51 42.67,36.68 v42.67,37.59
  Bottom 0.305: v42.67,37.59 42.67,45.85 CLK.T
DISP_CS  (via drill 0.3 pad 0.64)
  Top 0.203: v44.58,38.23 44.58,37.85 44.91,37.51 U2.14
  Bottom 0.305: v44.58,38.23 44.58,40.77 47.75,43.94 47.75,45.85 CS.T
DISP_D/C  (via drill 0.3 pad 0.64)
  Top 0.203: v43.94,37.59 43.94,37.06 44.49,36.51 U2.13
  Bottom 0.305: v43.94,37.59 43.94,42.04 D/C.T
DISP_DATA  (via drill 0.3 pad 0.64)
  Top 0.203: U2.12 44.6,35.51 43.31,36.8 v43.31,38.23
  Bottom 0.305: v43.31,38.23 43.31,43.94 DATA.T
DSR
  Top 0.203: J4.3 64.9,18.54 62.87,18.54 62.23,19.18 62.23,21.21 60.96,22.48 60.96,29.56 59.79,30.73 48.13,30.73 46.91,29.51 U2.6
EXT_VIN
  Top 1.27: D1.+ 54.36,13.79 C23.2 54.36,9.53 47.5,2.67 U4.25
GND  (via drill 0.3 pad 0.64)
  Top 0.406: P1.2 39.5,8.38 | U2.59 33.16,22.11 32.93,22.35 v31.94,22.35 | U2.61 35.16,22.15 35.37,22.35 v36.89,22.35
  other vias: 53.47,37.59 11.56,23.62 9.65,23.62 9.65,22.35 11.56,22.35 19.81,23.62 16.64,19.81 19.81,19.81 1.4,10.29 42.29,16.64 32.32,18.54 32.32,16 32.26,13.46 29.97,13.46 29.97,10.92 29.97,8.38 31.24,8.38 35.05,8.38 36.32,8.38 38.86,8.38 41.4,8.38 42.29,18.92 1.4,8.38 1.4,4.57 2.67,10.29 1.4,12.19 1.4,14.73 1.4,17.27 1.4,19.81 1.4,22.35 1.4,24.89 1.4,27.43 3.94,27.43 6.48,27.43 9.02,27.43 11.56,27.43 11.68,31.24 2.67,8.38 38.8,22.35 8.38,10.29 8.38,9.02 19.81,30.61 19.81,27.43 24,37.72 24,36.7 12.95,31.24 16.64,44.58 18.54,44.58 21.72,44.58 31.24,42.67 33.66,42.67 37.34,47.12 31.24,38.23 33.15,38.23 40.13,46.48 42.04,46.48 28.7,10.92 28.7,8.38 28.7,6.48 29.97,6.48 31.24,6.48 32.51,8.38 33.78,8.38 34.42,6.48 36.96,6.48 38.86,6.48 37.59,8.38 43.43,8.38 42.29,14.1 42.29,11.56 32.32,17.27 32.32,14.73 28.7,12.19 29.97,12.19 28.7,9.65 29.97,9.65 42.29,10.03 43.43,10.03 43.43,11.56 42.29,12.83 43.43,12.83 43.43,14.1 42.29,15.37 43.43,15.37 43.43,16.64 42.29,17.78 43.43,17.78 43.43,18.92 31.24,13.46 31.24,14.73 29.97,14.73 40.13,8.38 42.29,8.38 54.1,24.26 52.2,24.26 50.29,24.26 61.09,9.65 59.18,11.56 42.04,6.48 1.4,6.48 61.09,11.56 27.05,13.21 44.58,18.92 44.58,17.78 44.58,16.64 44.58,15.37 44.58,14.1 44.58,12.83 44.58,11.56 44.58,10.03 44.58,8.38 44.58,6.48 59.18,9.65 57.28,9.65 57.28,7.75 59.18,7.75 61.09,7.75 56.01,24.26 57.91,25.53 57.91,24.26 26.16,13.21 19.81,29.34 20.45,12.83 19.18,12.83 17.91,12.83 16.64,12.83 15.37,12.83 17.91,11.05 14.1,12.83 38.86,28.07 41.4,28.07 23.62,23.62 22.99,22.99 12.83,44.58 6.48,44.58 5.84,31.24 5.84,35.69 12.83,42.04 12.83,39.5 28.07,47.75 29.97,47.75 21.72,42.04 26.8,42.04 26.8,38.23 28.7,38.23 26.8,40.13 47.5,40.51 29.27,22.35 36.13,19.18 37.15,19.18 38.16,19.18 39.18,19.18 40.7,18.92 47.12,8.38 49.02,9.65 49.02,8.51 45.59,8.38 48.39,19.81 52.71,19.81 15.37,8 17.27,8 10.67,8.76 26.16,12.32 16.64,23.11 19.81,35.69 19.81,34.04 17.91,33.02 56.01,25.53 54.1,25.53 52.2,25.53
  pour Top (isolate 0.254, rank 6): 0.13,53.47 68.71,53.47 68.71,0.13 0.13,0.13
  pour Bottom (isolate 0.254, rank 6): 0.13,53.47 68.71,53.47 68.71,0.13 0.13,0.13
GPIO1  (via drill 0.3 pad 0.64)
  Top 0.254: U2.40 23.7,35.51 24,35.81 27.94,35.81 v29.34,34.42
  Bottom 0.254: J3.1 58.55,45.21 58.55,43.56 56.83,41.85 56.83,32.93 55.35,31.44 50.09,31.44 47.12,34.42 v29.34,34.42
GPIO2  (via drill 0.3 pad 0.64)
  Top 0.254: U2.41 23.59,34.51 24.38,35.31 27.18,35.31 v28.7,33.78
  Bottom 0.254: J3.2 57.28,41.4 57.28,32.51 55.69,30.92 49.91,30.92 47.05,33.78 v28.7,33.78
GPIO3  (via drill 0.3 pad 0.64)
  Top 0.254: U2.42 23.51,33.51 24.57,32.45 27.05,32.45 27.75,33.15 v29.34,33.15
  Bottom 0.254: J3.3 57.72,39.31 57.72,32.2 55.94,30.42 49.72,30.42 46.99,33.15 v29.34,33.15
GPIO4  (via drill 0.3 pad 0.64)
  Top 0.254: U2.43 23.68,32.51 24.26,31.94 27.3,31.94 27.88,32.51 v28.7,32.51
  Bottom 0.254: J3.4 58.17,37.21 58.17,31.88 56.26,29.97 49.47,29.97 46.93,32.51 v28.7,32.51
GPIO5  (via drill 0.3 pad 0.64)
  Top 0.254: U2.44 22.18,31.5 27.62,31.5 28,31.88 v29.34,31.88
  Bottom 0.254: J3.5 58.61,35.12 58.61,31.56 56.52,29.46 49.28,29.46 46.86,31.88 v29.34,31.88
GPIO6  (via drill 0.3 pad 0.64)
  Top 0.254: U2.47 25.97,28.51 v28.7,31.24
  Bottom 0.254: v28.7,31.24 46.74,31.24 49.02,28.96 56.77,28.96 59.82,32 J3.6
HRXD  (via drill 0.3 pad 0.64)
  Top 0.254: Q6.3 51.31,35.94 52.32,36.96 v55.37,36.96 55.62,36.71 R8.1
  Bottom 0.254: v55.37,36.96 55.37,45.21 J7.2
HTXD  (via drill 0.3 pad 0.64)
  Top 0.254: Q7.3 v54.48,35.94 54.98,35.44 R8.2
  Bottom 0.254: v54.48,35.94 54.48,37.34 54.86,37.72 54.86,43.18 J7.5
LDTR  (via drill 0.3 pad 0.64)
  Top 0.203: U2.3 46.96,26.51 46.99,26.54 47.58,26.54 48.26,27.23 48.26,28.57 49.15,29.46 59.18,29.46 59.82,28.83 59.82,24.51 v59.56,24.26
  Bottom 0.305: v59.56,24.26 59.56,23.88 J4.6
LINEIN_L
  Top 0.254: U2.24 36.16,43.21 36.96,42.42 42.55,42.42 43.9,43.77 49.32,43.77 50.74,42.35 54.8,42.35 55.25,41.91 55.25,41.15 C8.2
LINEIN_R
  Top 0.254: U2.23 37.16,43.23 37.47,42.93 42.42,42.93 43.78,44.29 49.43,44.29 50.93,42.8 55.25,42.8 56.26,41.78 56.26,40.13 55.37,39.24 C7.2
LRTS
  Top 0.203: U2.8 60.18,31.51 61.72,29.97 61.72,22.81 62.18,22.35 J4.5
LRXD
  Top 0.254: 50.67,33.98 Q6.2 50.61,34.73 | U2.10 47.36,33.51 47.75,33.91 47.75,34.64 48.04,34.93 50.42,34.93 | 50.42,34.93 50.67,34.93 | 50.67,34.93 50.8,34.93 | 50.8,34.93 54.74,34.93 54.99,34.67 R8.3 | 50.61,34.74 50.61,34.86 50.67,34.93 | 50.61,34.73 50.61,34.74 | 50.61,34.74 50.42,34.93 | 50.61,34.73 50.8,34.93 | 55.68,34.67 R8.3 | R8.3
LTXD
  Top 0.254: R8.4 54.09,33.85 Q7.2 53.98,33.85 53.98,32.77 53.21,32 48.01,32 47.5,32.51 U2.9
MRXD
  Top 0.254: J7.1 U4.2
MTXD
  Top 0.254: U4.1 61.72,49.02 59.94,49.02 58.29,47.37 58.29,45.59 J7.6
N$1
  Top 0.406: U2.60 R10.2 C10.2
N$2  (via drill 0.3 pad 0.64)
  Top 0.406: v48.39,18.54 50.16,16.76 Q5.3 50.93,16.89 51.05,17.02
  Top 1.27: 51.69,17.02 51.05,17.02 51.69,17.65 | 51.69,17.02 52.32,17.02 | 52.32,17.02 53.42,17.02 D2.+ | R23.1 51.69,17.65 | 51.69,17.65 51.69,17.02 | 51.69,17.65 52.32,17.02
  Bottom 0.305: 42.8,24.13 25.54,24.13 22.99,21.57 T_5V.T
  Bottom 0.406: v48.39,18.54 42.8,24.13
N$3
  Top 0.254: Q3.3 R20.2
N$4  (via drill 0.3 pad 0.64)
  Top 0.406: R19.2 v51.94,37.59 | v42.48,27.18 42.48,35.69 v42.55,35.75
  Bottom 0.406: v51.94,37.59 51.94,36.96 51.31,36.32 43.12,36.32 v42.55,35.75 | v42.48,27.18 44.64,27.18 49.91,21.91 49.91,17.72 48.77,16.57 SIMHOLDER.4
N$5  (via drill 0.3 pad 0.64)
  Top 0.406: R18.1 v50.29,37.59
  Bottom 0.254: SIMHOLDER.3 48.69,38.69 49.78,37.59 v50.29,37.59
N$6  (via drill 0.3 pad 0.64)
  Top 0.406: R17.1 48.51,37.72 v48.64,37.59
  Bottom 0.254: SIMHOLDER.2 51.14,37.29 50.8,36.96 49.28,36.96 v48.64,37.59
N$7
  Top 0.305: R20.1 D3/NET.-
N$8
  Top 0.305: Q3.1 10.48,6.16 R15.1 R13.2
N$9
  Top 0.305: PWR.- 25.65,1.91 26.8,3.05 26.8,4.7 R1.2
N$10  (via drill 0.3 pad 0.64)
  Top 0.305: v23.62,20.45 26.1,20.45 U2.52 | v23.62,9.03 13.6,9.03 R13.1
  Bottom 0.305: v23.62,9.03 v23.62,20.45
N$11  (via drill 0.3 pad 0.64)
  Top 0.305: v26.04,22.67 26.04,24.13 29.99,28.09 37.57,28.09 40.15,25.51 U2.2 | v24.89,7.75 22.99,7.75 19.56,4.32 19.43,4.19 18.92,3.68 POWER_KEY.1
  Bottom 0.305: v24.89,7.75 24.89,21.53 v26.04,22.67
N$12
  Top 0.254: R4.1 4.06,23.3 4.95,24.19 9.08,24.19 9.4,24.51 U1.7
N$13  (via drill 0.3 pad 0.64)
  Top 0.305: R12.1 C12.1 v18.8,31.5
  Top 0.61: U2.19 41.16,45.96 v41.15,45.97
  Bottom 0.305: v41.15,45.97 41.15,37.34 38.86,35.05 22.35,35.05 v18.8,31.5
N$15
  Top 0.305: L3.1 C13.1 C18.2 C14.2 | C14.2 C17.1 | C14.2 19.3,37.21 19.81,37.21 20.07,37.47 20.07,46.36 23.11,49.4 36.83,49.4 38.86,47.37 38.86,46.1 39.16,45.8 U2.21
N$16
  Top 0.305: Q4.3 14.35,5.97 R21.2
N$17
  Top 0.305: D2/STA.- R21.1
N$18
  Top 0.254: R14.2 R16.1 16.38,6.35 Q4.1
N$19
  Top 0.254: C14.1 18.92,36.2
  Top 0.305: L1.1 C19.2 C18.1 C14.1 C15.2 | 18.92,36.2 18.92,36.32 19.3,36.7 20.07,36.7 20.57,37.21 20.57,46.1 23.37,48.9 36.58,48.9 38.35,47.12 38.35,46.1 38.16,45.91 U2.22
N$20  (via drill 0.3 pad 0.64)
  Top 0.305: U2.66 40.16,23.27 36.51,26.92 30.99,26.92 27.94,23.88 v27.94,22.67 | v24.26,8.38 20.19,8.38 R14.1
  Bottom 0.305: v24.26,8.38 24.26,21.92 25.7,23.37 27.69,23.37 27.94,23.11 v27.94,22.67
N$21
  Top 0.406: C11.2 R10.1 R11.2 ANT1.D
N$23
  Top 0.254: J13.6 63.63,45.21 63.63,43.31 62.99,42.67 59.18,42.67 58.55,42.04 58.55,40.51 57.15,39.12 C7.1
N$29
  Top 0.254: C8.1 57.15,41.28 57.91,42.04 57.91,43.94 59.18,45.21 61.09,45.21 J13.5
N$30
  Top 0.305: L4.1 C16.2 R12.2
N$31
  Top 0.406: R22.1 48.71,16 Q5.1
N$36
  Top 0.406: R3.2 R2.1 51.88,28.32 Q1.1
N$38
  pour Top (isolate 0.254, rank 2, no thermals): 10.41,21.59 11.18,21.59 11.18,18.67 arc90 11.56,18.29 12.07,18.29 arc-90 12.45,17.91 12.45,9.98 arc-91 12.06,9.6 9.96,9.64 arc-89 9.59,10.02 9.59,17.91 arc-90 9.97,18.29 10.03,18.29 arc90 10.41,18.67
N$39
  Top 0.406: C22.1 49.53,12.32 R24.1 R22.2 46.86,14.48 46.48,14.1 D4.2
N$45
  Top 0.305: 14.1,30.35 L4.2 12.67,28.8 6.11,28.8 D7.2 4.75,29.97 2.88,31.84 2.86,31.87 2.5,32.22 J6.1
N$47
  Top 0.305: C1.2 R6.1 R5.1 12.45,24 11.94,24.51 U1.5
N$48
  Top 0.305: D5.2 9.53,43.94 8.95,43.37 8.86,43.27 8.8,43.22 J6.4 8.8,38.78 9.23,38.35 13.46,38.35 13.84,38.73 13.84,40.39 14.35,40.89 L3.2
N$51
  Top 0.305: D6.2 9.4,29.97 8.4,30.97 J6.3 8.4,35 8.96,35.56 13.34,35.56 13.84,35.05 13.84,33.66 14.48,33.02 L1.2
N$52
  Top 0.406: R11.1 38.23,14.86 arc-90 39.5,13.59 P1.1
PWM1  (via drill 0.3 pad 0.64)
  Top 0.254: v30.61,29.97 30.61,34.96 28.67,36.89 27.05,36.89 23.43,40.51 U2.35
  Bottom 0.254: v30.61,29.97 46.42,29.97 48.51,27.88 57.21,27.88 62.36,33.02 J13.1
PWM2  (via drill 0.3 pad 0.64)
  Top 0.254: v29.97,30.61 29.97,34.75 28.4,36.32 26.8,36.32 23.61,39.51 U2.36
  Bottom 0.254: J13.2 61.09,35.05 61.09,32.51 57.02,28.45 48.77,28.45 46.61,30.61 v29.97,30.61
PWRKEY  (via drill 0.3 pad 0.64)
  Top 0.305: v26.99,22.67 26.99,24 30.48,27.49 36.9,27.49 39.88,24.51 U2.1 | v25.53,7.11 23.62,7.11 21.97,5.46 POWER_KEY.2
  Top 0.406: U2.1 47.37,24.51 49.28,26.42 Q1.3
  Bottom 0.305: v25.53,7.11 25.53,21.21 v26.99,22.67
RI
  Top 0.203: J4.1 64.45,13.01 62.27,13.01 61.47,13.82 61.47,20.95 60.2,22.22 60.2,29.07 59.3,29.97 49.02,29.97 47.75,28.7 47.75,27.81 47.45,27.51 U2.4
SIM_CLK
  Top 0.254: U2.32 28.16,42.73 30.48,40.41 43.08,40.41 44.46,41.79 48.76,41.79 R18.2 50.04,40.26
SIM_DATA
  Top 0.254: U2.31 29.16,42.47 30.74,40.89 42.93,40.89 44.32,42.29 48.9,42.29 50.16,41.02 51.18,41.02 R19.1
SIM_RST
  Top 0.254: U2.33 27.16,42.95 30.22,39.89 43.19,39.89 44.58,41.28 48.26,41.28 48.51,41.02 R17.2
SIM_VDD  (via drill 0.3 pad 0.64)
  Top 0.254: U2.30 30.16,42.31 31.07,41.4 42.8,41.4 44.18,42.78 49.04,42.78 50.36,41.47 53.15,41.47 v53.47,41.15 C20.1
  Bottom 0.254: SIMHOLDER.1 53.74,40.88 v53.47,41.15
SRXD
  Top 0.254: J7.3 51.56,47.75 50.93,48.39 44.32,48.39 U4.9
STXD
  Top 0.254: U4.8 47.75,49.02 51.42,49.02 52.83,47.61 52.83,45.21 J7.4
VBAT  (via drill 0.3 pad 0.64)
  Top 0.254: D3/NET.+ v9.33,3.43 D2/STA.+
  Top 0.305: 27.43,15.75 27.3,15.88 C5.2 | 28.45,15.24 28.45,13.46 26.16,11.18 26.16,3.94 25.65,3.43 PWR.+ 25.4,3.3 v24.26,3.3
  Top 0.406: R6.2 C1.1 15.24,17.58 L2.2 | C5.2 27.94,15.88 28.45,15.37 28.45,15.24 | 28.45,15.24 28.19,15.49 | 28.45,15.24 28.7,15.49
  Bottom 0.305: v24.26,3.3 23.11,3.3 | 23.11,3.3 22.35,3.3 21.72,3.94 9.84,3.94 v9.33,3.43 | T_4.1V.T 22.99,3.17 23.11,3.3
  pour Top (isolate 0.406, no thermals): 28.96,21.4 31.37,21.4 31.37,18.54 arc-90 28.19,15.37 18.8,15.49 arc90 18.16,14.73 arc-90 17.53,14.22 15.37,14.22 arc-90 14.99,14.61 14.99,17.53 arc-90 15.37,17.91 28.32,17.91 arc90 28.96,18.54
VDD_EXT  (via drill 0.3 pad 0.64)
  Top 0.406: Q6.1 48.71,33.08 49.02,32.77 v52.07,32.77 52.07,33.84 Q7.1 | U2.15 47.47,38.51 47.62,38.35 47.62,36.07 v48.13,35.56 | 56.62,34.07 56.84,33.85 R8.5 57.15,32.32 57.09,32.26 | R8.6 56.84,34.68 56.62,34.46 56.62,34.07 | 56.62,34.07 | v61.72,31.24 60.96,32 57.47,32 | 57.47,32 57.09,32 | 56.83,32 55.5,32 v54.74,32.77 | 57.15,32.06 57.09,32 | 57.47,32 57.21,32.26 57.09,32.26 | 57.09,32.26 56.83,32 | 56.83,32 57.09,32
  Bottom 0.406: v48.13,35.56 50.93,32.77 v52.07,32.77 v54.74,32.77 | v61.72,31.24 61.72,24.82 62.54,24 64.01,24 64.9,23.11 64.9,18.54 J4.7
VIN  (via drill 0.64 pad 1.78)
  Top 0.406: C24.2 R4.2
  Top 1.778: C2.+ 6.35,15.49
  Top 2.032: v48.01,21.59 57.53,21.59 58.73,20.4 D2.- D1.- | D1.- 58.73,13.26 58.67,13.21 58.67,13.79 D1.- | 6.35,15.49 v6.35,13.59
  Bottom 0.406: 21.72,24.51 21.72,25.35 21.97,25.6 | 21.72,24.51 21.21,25.02 | 21.72,24.51 22.1,24.89 | 21.72,24.51 21.72,5.84 T_EXT.T
  Bottom 2.032: v48.01,21.59 43.99,25.6 21.97,25.6 10.69,25.6 arc90 6.35,21.9 v6.35,13.59
  pour Top (isolate 0.254, no thermals): 9.14,21.59 9.91,21.59 9.91,19.38 arc-90 9.45,18.92 arc90 8.95,18.43 8.95,15.24 arc-90 8.32,14.61 5.21,14.61 arc-90 5.08,14.73 5.08,19.05 arc-90 5.71,19.68 8.62,19.68 arc90 9.14,20.21
VRTC  (via drill 0.38 pad 0.81)
  Top 0.61: U2.26 34.16,46.99 C6.2
  Top 1.016: v32.51,47.12 C6.2
  Bottom 1.016: J1.+ 31.06,45.66 v32.51,47.12

### Text on the board
tPlace: SW_uart | GPIO | R | HW_uart | L | GND | ADC | PWM2 | PWM1 | LRTS | CTS | LDTR | DSR | VCC | DCD | RI | GND
bPlace: 1 | 1 | 1 | 1 | 9 | 8 | 7 | 6 | 5 | 4 | 3 | 2 | 1 | 0 | SCL | SDA | GND | 3 | 2 | 1 | 0 | AREF | FW_Update | SIMHOLDER | GPRS Shield | v3.0 04/29/2014 | by Seeed Studio | www.seeedstudio.com | ANALOG | NC | IOREF | RST | 3V3 | 5V | GND | GND | VIN | 0 | 1 | 2 | 3 | 4 | 5